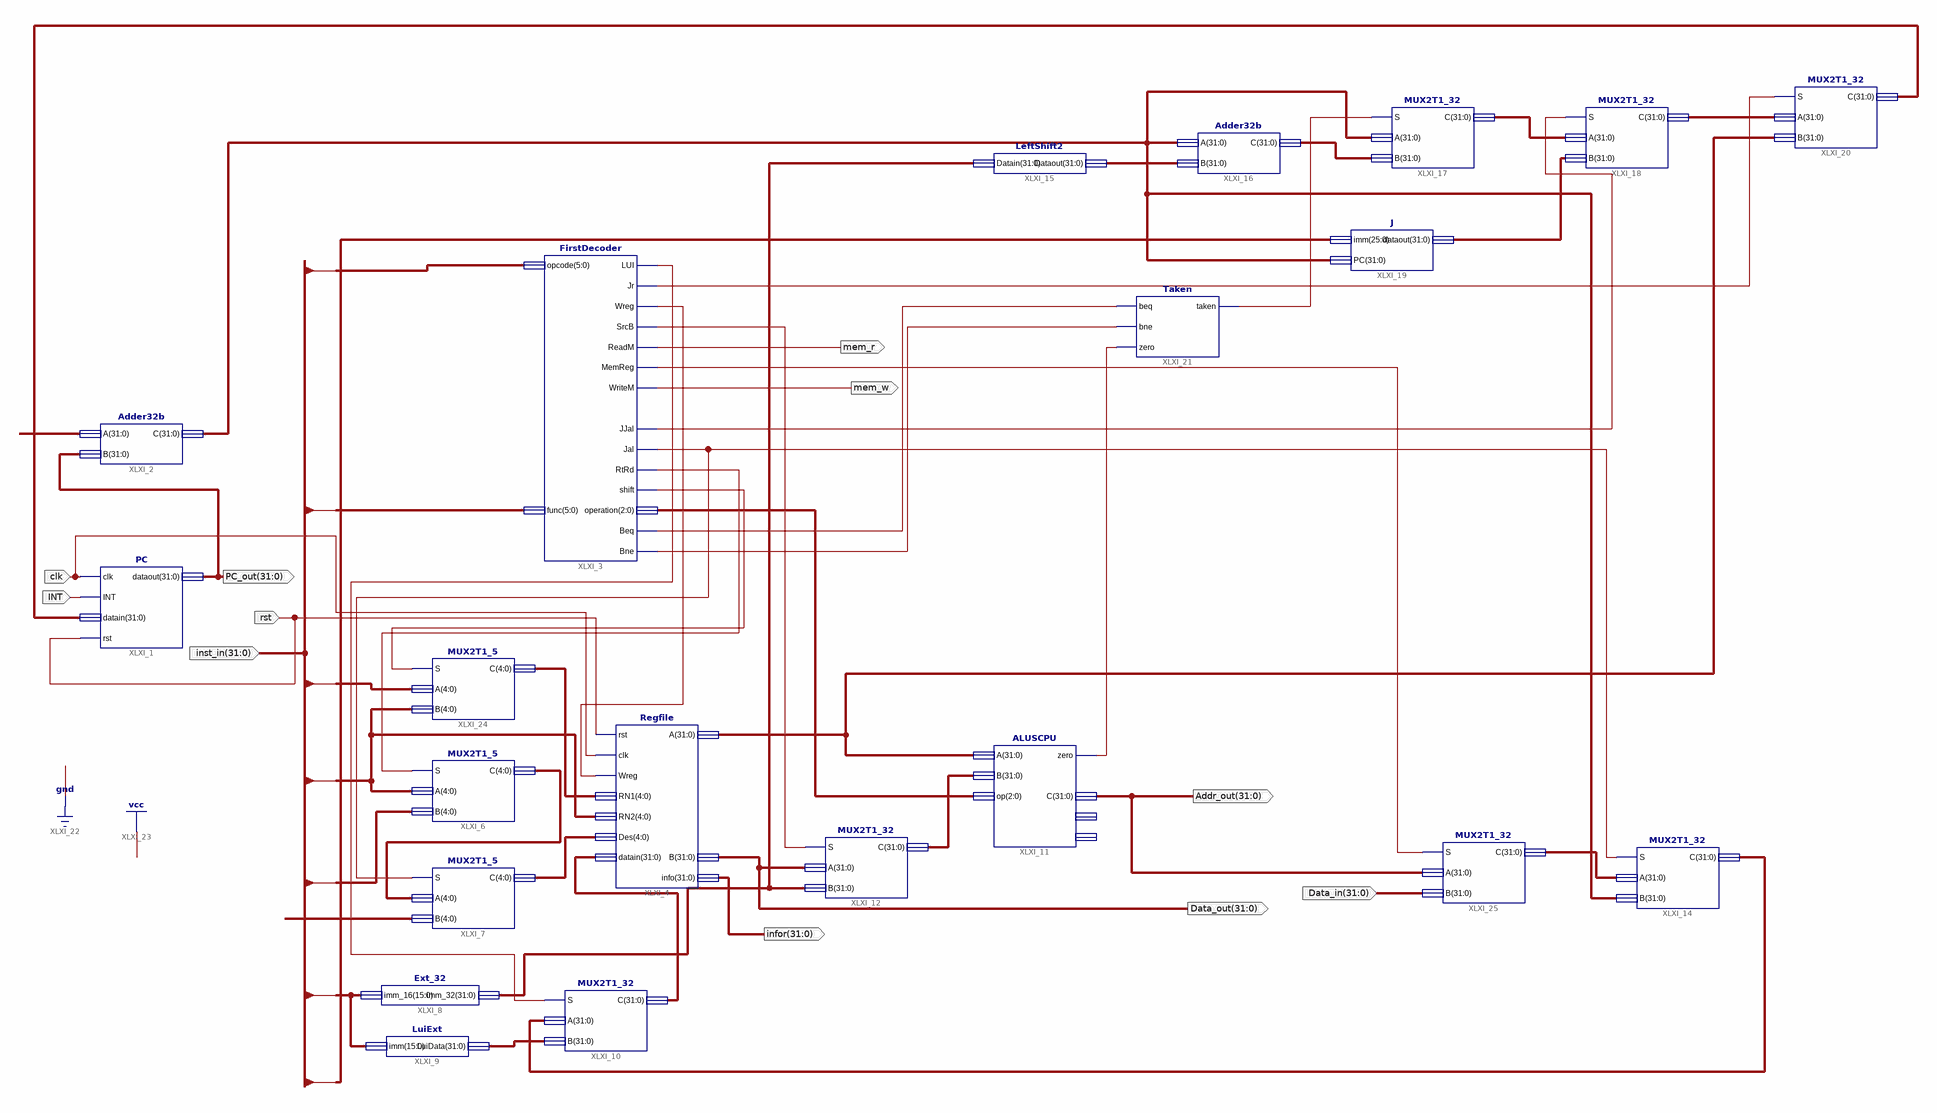
[diagram p0: schematic sheet 1]
// Xilinx ISE schematic SCPU.sch (kintex7) as structural Verilog: 21 symbols, 11 ports
module SCPU (
  input  clk,
  input  INT,
  input  [31:0] inst_in,
  input  rst,
  input  [31:0] Data_in,
  output [31:0] PC_out,
  output [31:0] Data_out,
  output [31:0] Addr_out,
  output mem_r,
  output mem_w,
  output [31:0] infor
);

  wire Jal, Jr, LUI, MemReg, take, Wreg, XLXN_23, XLXN_30, XLXN_38, XLXN_52, XLXN_68, XLXN_71, XLXN_73;
  wire [2:0] op;
  wire [4:0] Reg_des, RN1, XLXN_11;
  wire [31:0] A, AA, B, BB, C1, Reg_data_in, XLXN_15, XLXN_16, XLXN_20, XLXN_49, XLXN_50, XLXN_51, XLXN_53,
       XLXN_57;

  PC XLXI_1 (.clk(clk), .INT(INT), .datain(XLXN_53), .dataout(PC_out), .rst(rst));
  Adder32b XLXI_2 (.A(32'b00000000000000000000000000000100), .B(PC_out), .C(AA));
  FirstDecoder XLXI_3 (
    .opcode(inst_in[31:26]), .func(inst_in[5:0]), .LUI(LUI), .Jr(Jr), .Wreg(Wreg), .SrcB(XLXN_38),
    .ReadM(mem_r), .MemReg(MemReg), .WriteM(mem_w), .JJal(XLXN_52), .Jal(Jal), .RtRd(XLXN_30),
    .shift(XLXN_23), .operation(op), .Beq(XLXN_71), .Bne(XLXN_73));
  Regfile XLXI_4 (
    .rst(rst), .clk(clk), .Wreg(Wreg), .RN1(RN1), .RN2(inst_in[20:16]), .Des(Reg_des), .datain(Reg_data_in),
    .A(A), .B(Data_out), .info(infor));
  MUX2T1_5 XLXI_6 (.S(XLXN_30), .A(inst_in[20:16]), .B(inst_in[15:11]), .C(XLXN_11));
  MUX2T1_5 XLXI_7 (.S(Jal), .A(XLXN_11), .B({5{1'b1}}), .C(Reg_des));
  Ext_32 XLXI_8 (.imm_16(inst_in[15:0]), .imm_32(XLXN_16));
  LuiExt XLXI_9 (.imm(inst_in[15:0]), .LuiData(XLXN_15));
  MUX2T1_32 XLXI_10 (.S(LUI), .A(XLXN_20), .B(XLXN_15), .C(Reg_data_in));
  ALUSCPU XLXI_11 (.A(A), .B(B), .op(op), .zero(XLXN_68), .C(Addr_out));  // open: S, result1
  MUX2T1_32 XLXI_12 (.S(XLXN_38), .A(Data_out), .B(XLXN_16), .C(B));
  MUX2T1_32 XLXI_14 (.S(Jal), .A(C1), .B(AA), .C(XLXN_20));
  LeftShift2 XLXI_15 (.Datain(XLXN_16), .Dataout(BB));
  Adder32b XLXI_16 (.A(AA), .B(BB), .C(XLXN_49));
  MUX2T1_32 XLXI_17 (.S(take), .A(AA), .B(XLXN_49), .C(XLXN_51));
  MUX2T1_32 XLXI_18 (.S(XLXN_52), .A(XLXN_51), .B(XLXN_50), .C(XLXN_57));
  J XLXI_19 (.imm(inst_in[25:0]), .PC(AA), .dataout(XLXN_50));
  MUX2T1_32 XLXI_20 (.S(Jr), .A(XLXN_57), .B(A), .C(XLXN_53));
  Taken XLXI_21 (.beq(XLXN_71), .bne(XLXN_73), .zero(XLXN_68), .taken(take));
  MUX2T1_5 XLXI_24 (.S(XLXN_23), .A(inst_in[25:21]), .B(inst_in[20:16]), .C(RN1));
  MUX2T1_32 XLXI_25 (.S(MemReg), .A(Addr_out), .B(Data_in), .C(C1));
endmodule
